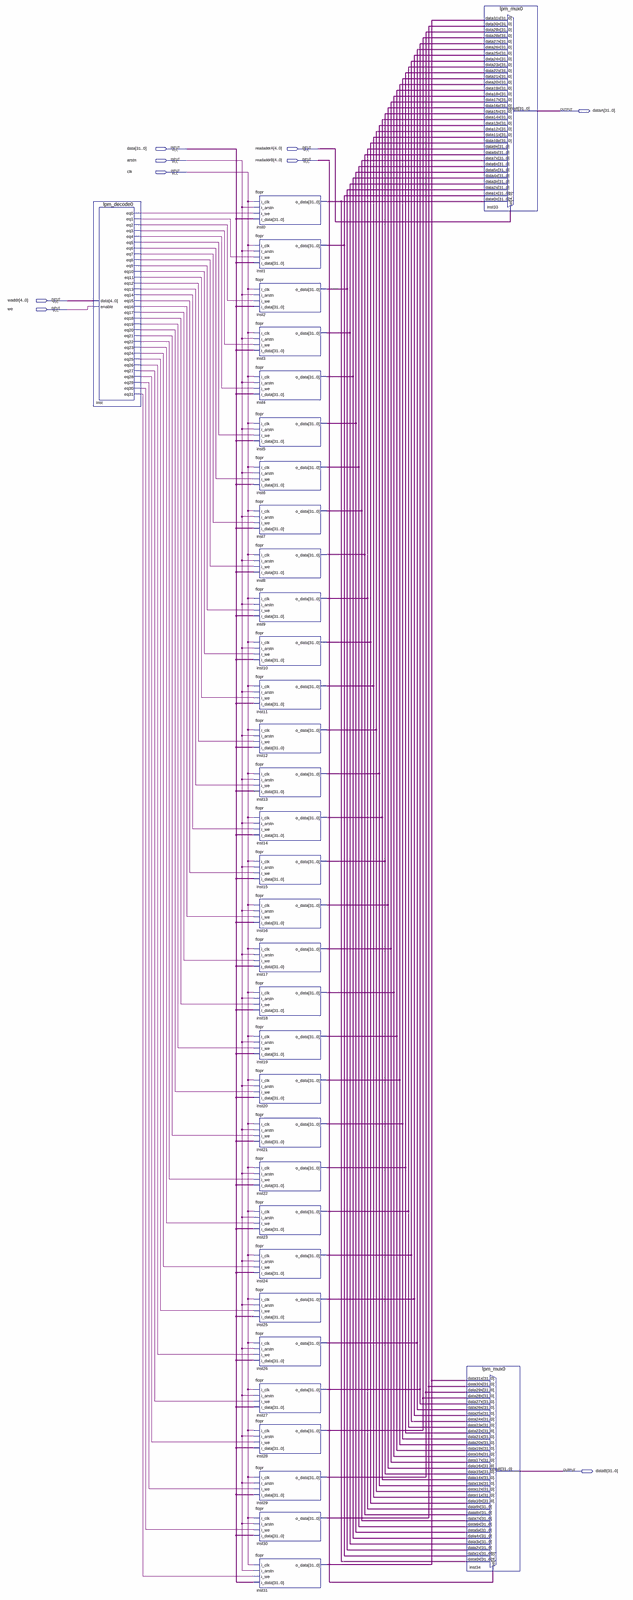
[diagram p0: schematic sheet, whole]
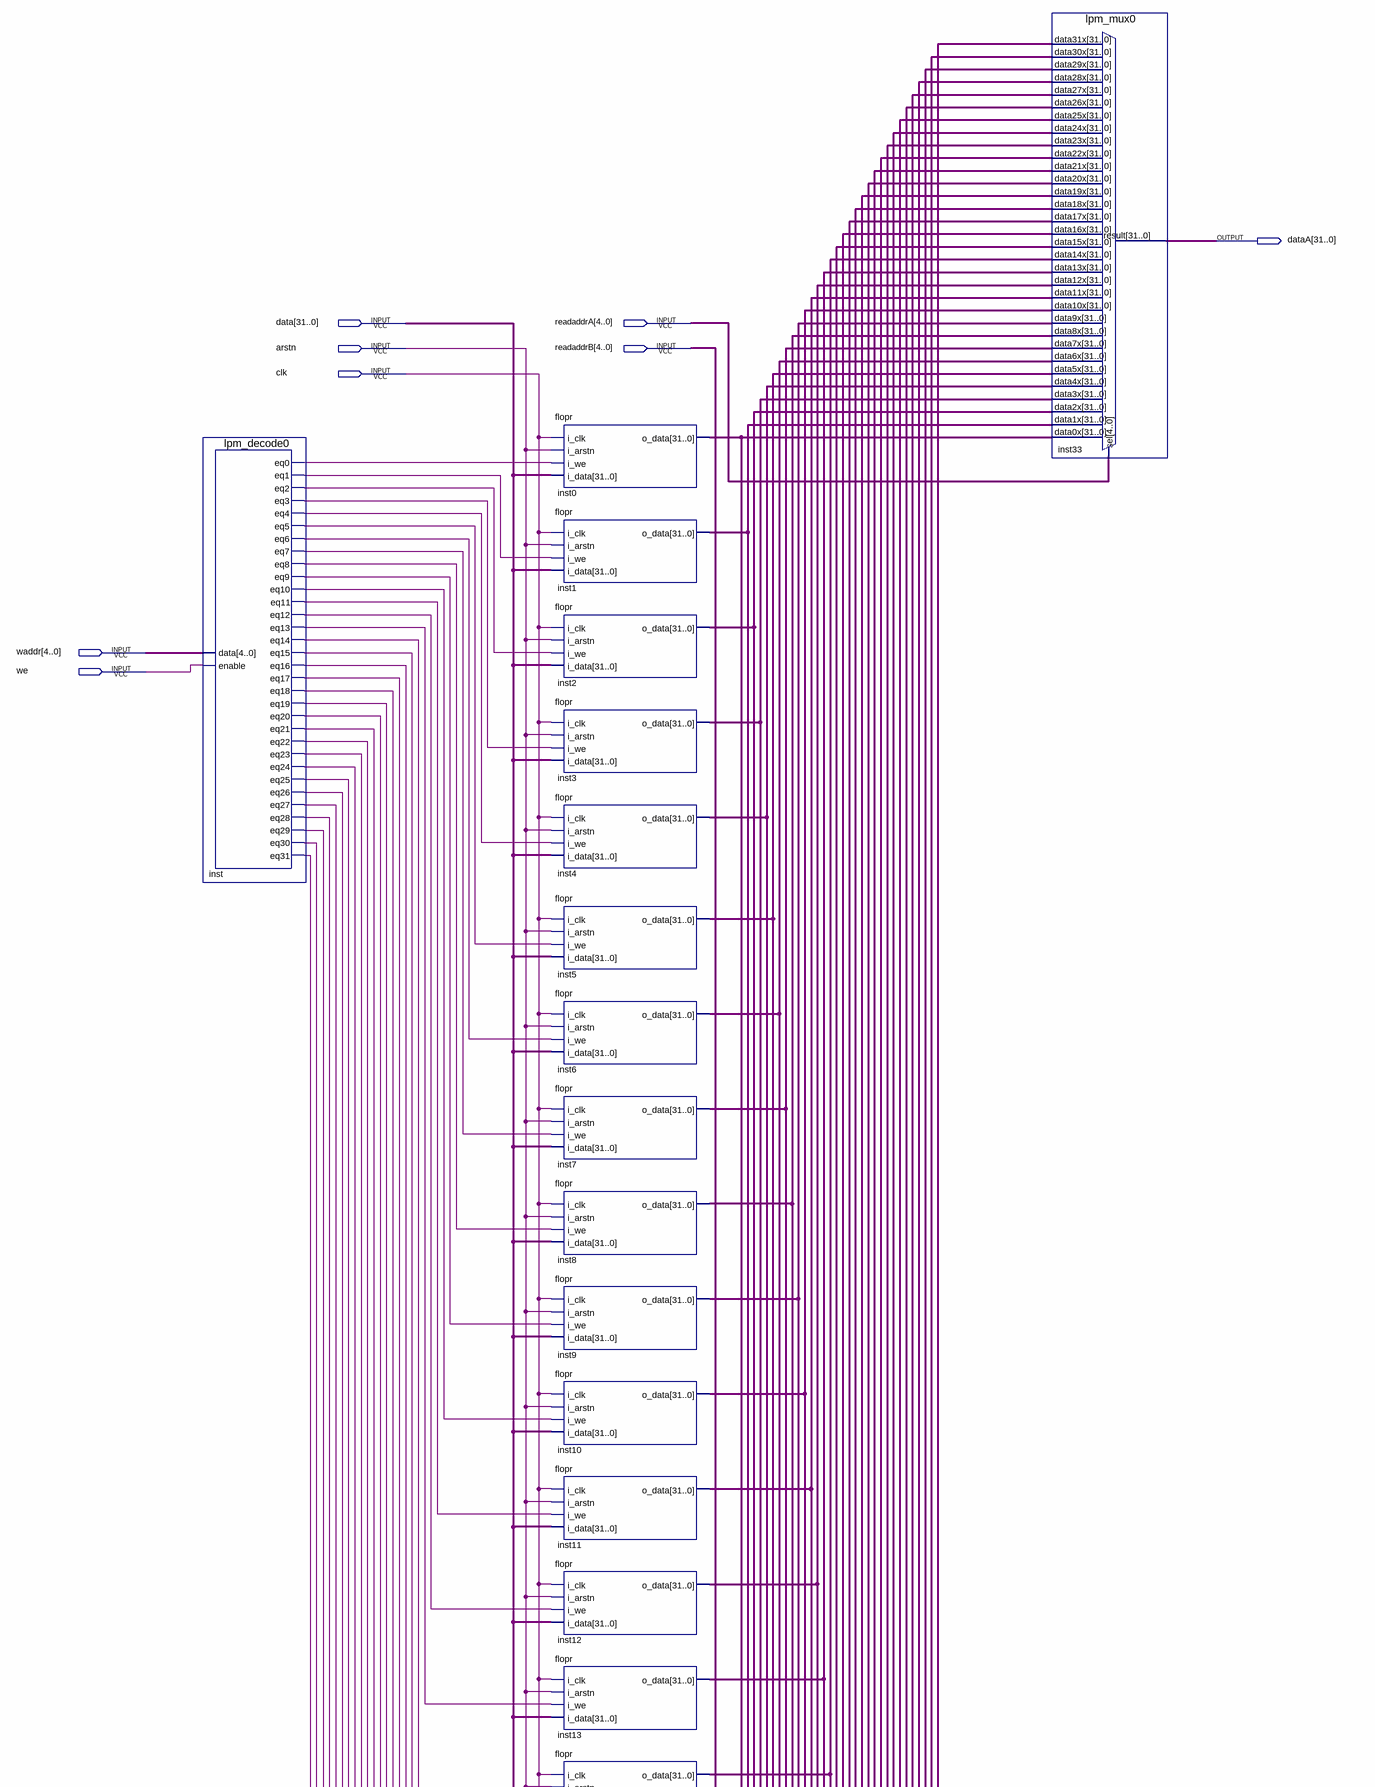
[diagram p1: schematic sheet, upper part]
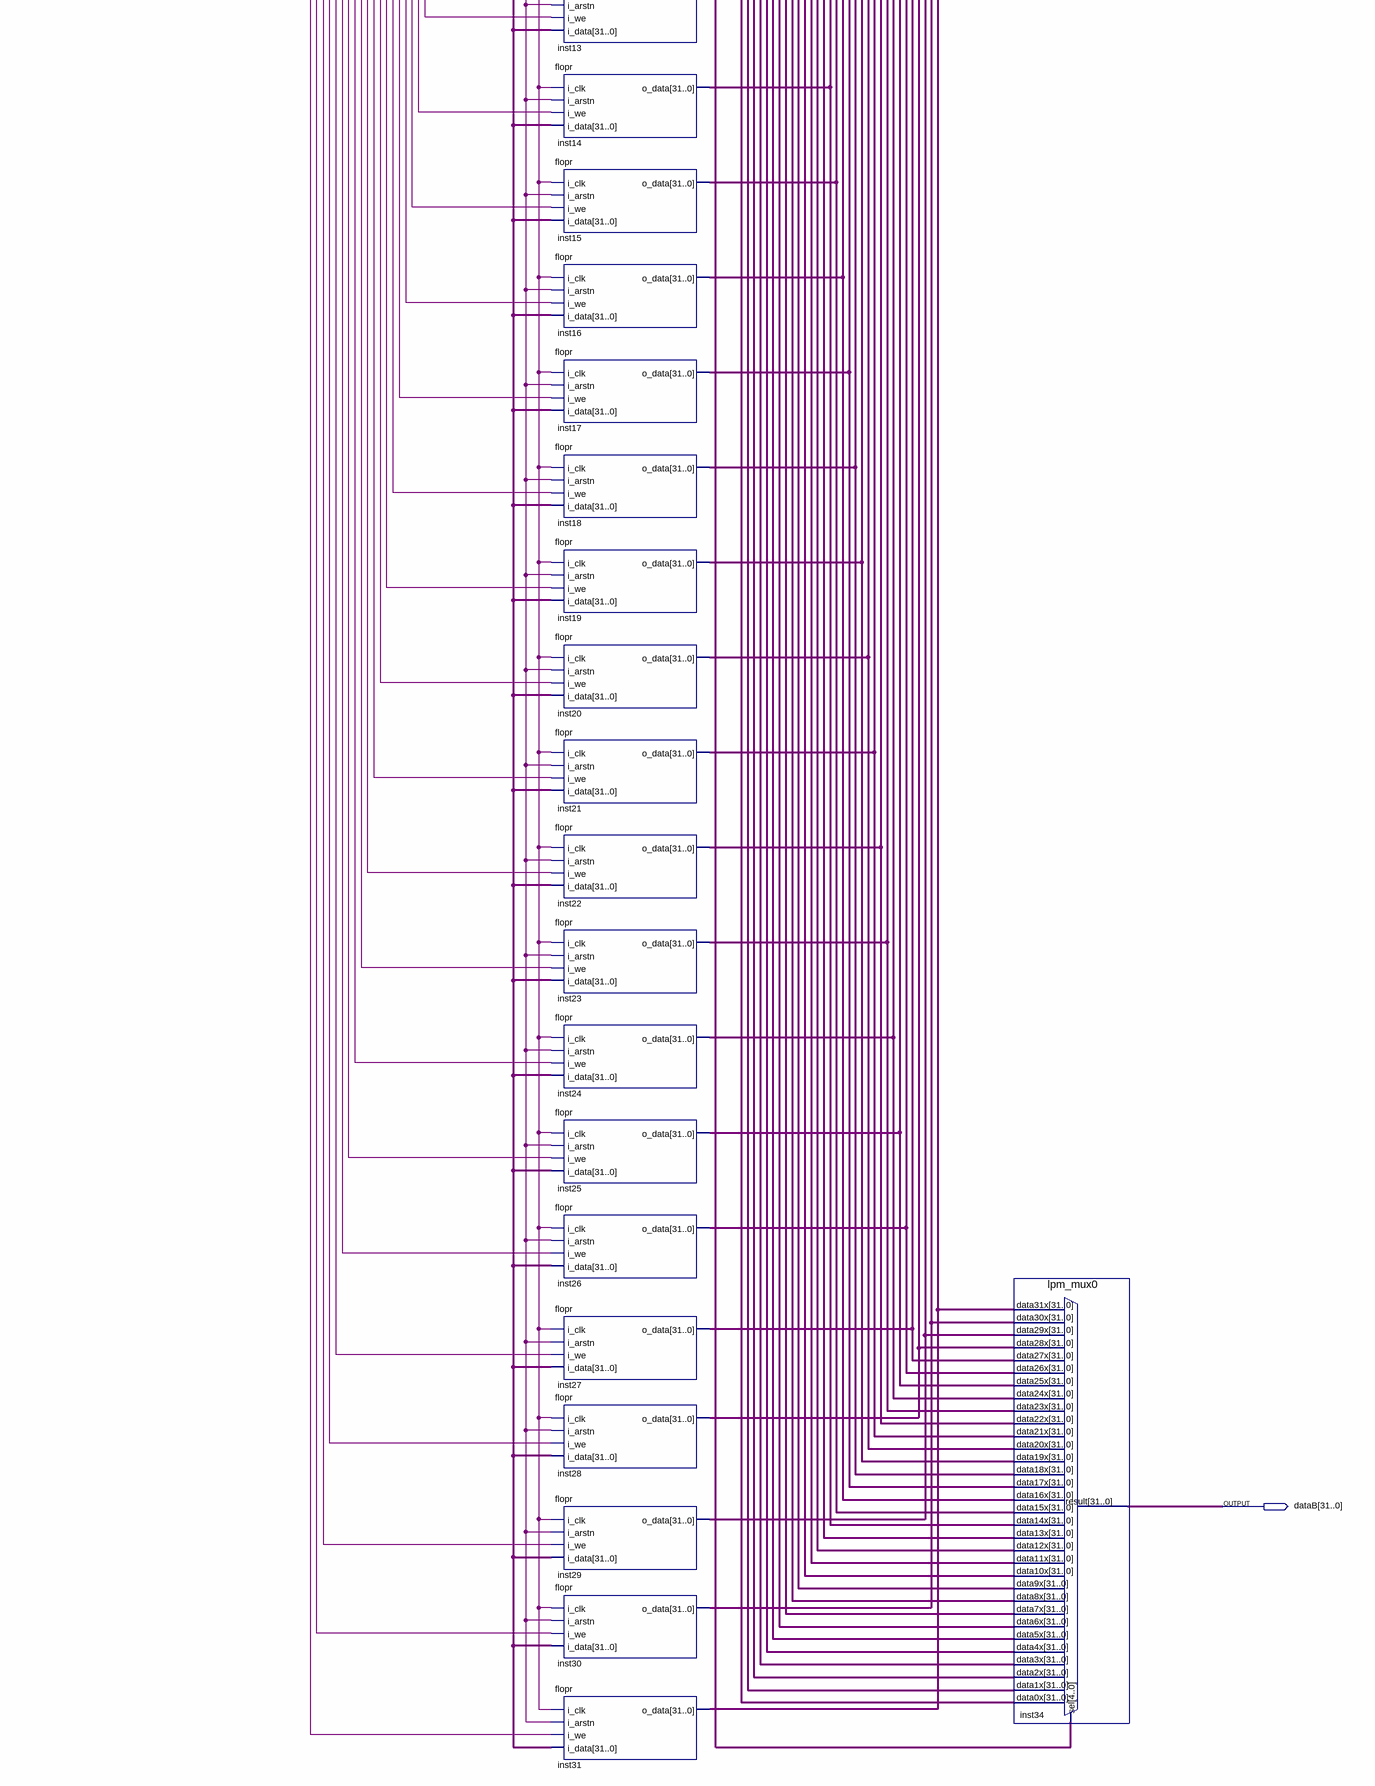
[diagram p2: schematic sheet, lower part]
// Quartus schematic lab2.bdf as structural Verilog: 35 symbols, 9 pins
module lab2 (
  input  [31:0] data,
  input  [4:0] readaddrA,
  input  arstn,
  input  [4:0] readaddrB,
  input  clk,
  input  [4:0] waddr,
  input  we,
  output [31:0] dataA,
  output [31:0] dataB
);

  wire inst_eq0, inst_eq1, inst_eq2, inst_eq3, inst_eq4, inst_eq5, inst_eq6, inst_eq7, inst_eq8, inst_eq9,
       inst_eq10, inst_eq11, inst_eq12, inst_eq13, inst_eq14, inst_eq15, inst_eq16, inst_eq17, inst_eq18,
       inst_eq19, inst_eq20, inst_eq21, inst_eq22, inst_eq23, inst_eq24, inst_eq25, inst_eq26, inst_eq27,
       inst_eq28, inst_eq29, inst_eq30, inst_eq31;
  wire [31:0] inst0_o_data, inst1_o_data, inst2_o_data, inst3_o_data, inst4_o_data, inst5_o_data,
       inst6_o_data, inst7_o_data, inst8_o_data, inst9_o_data, inst10_o_data, inst11_o_data, inst12_o_data,
       inst13_o_data, inst14_o_data, inst15_o_data, inst16_o_data, inst17_o_data, inst18_o_data,
       inst19_o_data, inst20_o_data, inst21_o_data, inst22_o_data, inst23_o_data, inst24_o_data,
       inst25_o_data, inst26_o_data, inst27_o_data, inst28_o_data, inst29_o_data, inst30_o_data,
       inst31_o_data;

  lpm_decode0 inst (
    .data(waddr), .enable(we), .eq0(inst_eq0), .eq1(inst_eq1), .eq2(inst_eq2), .eq3(inst_eq3),
    .eq4(inst_eq4), .eq5(inst_eq5), .eq6(inst_eq6), .eq7(inst_eq7), .eq8(inst_eq8), .eq9(inst_eq9),
    .eq10(inst_eq10), .eq11(inst_eq11), .eq12(inst_eq12), .eq13(inst_eq13), .eq14(inst_eq14),
    .eq15(inst_eq15), .eq16(inst_eq16), .eq17(inst_eq17), .eq18(inst_eq18), .eq19(inst_eq19),
    .eq20(inst_eq20), .eq21(inst_eq21), .eq22(inst_eq22), .eq23(inst_eq23), .eq24(inst_eq24),
    .eq25(inst_eq25), .eq26(inst_eq26), .eq27(inst_eq27), .eq28(inst_eq28), .eq29(inst_eq29),
    .eq30(inst_eq30), .eq31(inst_eq31));
  flopr inst0 (.i_clk(clk), .i_arstn(arstn), .i_we(inst_eq0), .i_data(data), .o_data(inst0_o_data));
  flopr inst1 (.i_clk(clk), .i_arstn(arstn), .i_we(inst_eq1), .i_data(data), .o_data(inst1_o_data));
  flopr inst2 (.i_clk(clk), .i_arstn(arstn), .i_we(inst_eq2), .i_data(data), .o_data(inst2_o_data));
  flopr inst3 (.i_clk(clk), .i_arstn(arstn), .i_we(inst_eq3), .i_data(data), .o_data(inst3_o_data));
  flopr inst4 (.i_clk(clk), .i_arstn(arstn), .i_we(inst_eq4), .i_data(data), .o_data(inst4_o_data));
  flopr inst5 (.i_clk(clk), .i_arstn(arstn), .i_we(inst_eq5), .i_data(data), .o_data(inst5_o_data));
  flopr inst6 (.i_clk(clk), .i_arstn(arstn), .i_we(inst_eq6), .i_data(data), .o_data(inst6_o_data));
  flopr inst7 (.i_clk(clk), .i_arstn(arstn), .i_we(inst_eq7), .i_data(data), .o_data(inst7_o_data));
  flopr inst8 (.i_clk(clk), .i_arstn(arstn), .i_we(inst_eq8), .i_data(data), .o_data(inst8_o_data));
  flopr inst9 (.i_clk(clk), .i_arstn(arstn), .i_we(inst_eq9), .i_data(data), .o_data(inst9_o_data));
  flopr inst10 (.i_clk(clk), .i_arstn(arstn), .i_we(inst_eq10), .i_data(data), .o_data(inst10_o_data));
  flopr inst11 (.i_clk(clk), .i_arstn(arstn), .i_we(inst_eq11), .i_data(data), .o_data(inst11_o_data));
  flopr inst12 (.i_clk(clk), .i_arstn(arstn), .i_we(inst_eq12), .i_data(data), .o_data(inst12_o_data));
  flopr inst13 (.i_clk(clk), .i_arstn(arstn), .i_we(inst_eq13), .i_data(data), .o_data(inst13_o_data));
  flopr inst14 (.i_clk(clk), .i_arstn(arstn), .i_we(inst_eq14), .i_data(data), .o_data(inst14_o_data));
  flopr inst15 (.i_clk(clk), .i_arstn(arstn), .i_we(inst_eq15), .i_data(data), .o_data(inst15_o_data));
  flopr inst16 (.i_clk(clk), .i_arstn(arstn), .i_we(inst_eq16), .i_data(data), .o_data(inst16_o_data));
  flopr inst17 (.i_clk(clk), .i_arstn(arstn), .i_we(inst_eq17), .i_data(data), .o_data(inst17_o_data));
  flopr inst18 (.i_clk(clk), .i_arstn(arstn), .i_we(inst_eq18), .i_data(data), .o_data(inst18_o_data));
  flopr inst19 (.i_clk(clk), .i_arstn(arstn), .i_we(inst_eq19), .i_data(data), .o_data(inst19_o_data));
  flopr inst20 (.i_clk(clk), .i_arstn(arstn), .i_we(inst_eq20), .i_data(data), .o_data(inst20_o_data));
  flopr inst21 (.i_clk(clk), .i_arstn(arstn), .i_we(inst_eq21), .i_data(data), .o_data(inst21_o_data));
  flopr inst22 (.i_clk(clk), .i_arstn(arstn), .i_we(inst_eq22), .i_data(data), .o_data(inst22_o_data));
  flopr inst23 (.i_clk(clk), .i_arstn(arstn), .i_we(inst_eq23), .i_data(data), .o_data(inst23_o_data));
  flopr inst24 (.i_clk(clk), .i_arstn(arstn), .i_we(inst_eq24), .i_data(data), .o_data(inst24_o_data));
  flopr inst25 (.i_clk(clk), .i_arstn(arstn), .i_we(inst_eq25), .i_data(data), .o_data(inst25_o_data));
  flopr inst26 (.i_clk(clk), .i_arstn(arstn), .i_we(inst_eq26), .i_data(data), .o_data(inst26_o_data));
  flopr inst27 (.i_clk(clk), .i_arstn(arstn), .i_we(inst_eq27), .i_data(data), .o_data(inst27_o_data));
  flopr inst28 (.i_clk(clk), .i_arstn(arstn), .i_we(inst_eq28), .i_data(data), .o_data(inst28_o_data));
  flopr inst29 (.i_clk(clk), .i_arstn(arstn), .i_we(inst_eq29), .i_data(data), .o_data(inst29_o_data));
  flopr inst30 (.i_clk(clk), .i_arstn(arstn), .i_we(inst_eq30), .i_data(data), .o_data(inst30_o_data));
  flopr inst31 (.i_clk(clk), .i_arstn(arstn), .i_we(inst_eq31), .i_data(data), .o_data(inst31_o_data));
  lpm_mux0 inst34 (
    .data31x(inst31_o_data), .data30x(inst30_o_data), .data29x(inst29_o_data), .data28x(inst28_o_data),
    .data27x(inst27_o_data), .data26x(inst26_o_data), .data25x(inst25_o_data), .data24x(inst24_o_data),
    .data23x(inst23_o_data), .data22x(inst22_o_data), .data21x(inst21_o_data), .data20x(inst20_o_data),
    .data19x(inst19_o_data), .data18x(inst18_o_data), .data17x(inst17_o_data), .data16x(inst16_o_data),
    .data15x(inst15_o_data), .data14x(inst14_o_data), .data13x(inst13_o_data), .data12x(inst12_o_data),
    .data11x(inst11_o_data), .data10x(inst10_o_data), .data9x(inst9_o_data), .data8x(inst8_o_data),
    .data7x(inst7_o_data), .data6x(inst6_o_data), .data5x(inst5_o_data), .data4x(inst4_o_data),
    .data3x(inst3_o_data), .data2x(inst2_o_data), .data1x(inst1_o_data), .data0x(inst0_o_data),
    .sel(readaddrB), .result(dataB));
  lpm_mux0 inst33 (
    .data0x(inst0_o_data), .data10x(inst10_o_data), .data11x(inst11_o_data), .data12x(inst12_o_data),
    .data13x(inst13_o_data), .data14x(inst14_o_data), .data15x(inst15_o_data), .data16x(inst16_o_data),
    .data17x(inst17_o_data), .data18x(inst18_o_data), .data19x(inst19_o_data), .data1x(inst1_o_data),
    .data20x(inst20_o_data), .data21x(inst21_o_data), .data22x(inst22_o_data), .data23x(inst23_o_data),
    .data24x(inst24_o_data), .data25x(inst25_o_data), .data26x(inst26_o_data), .data27x(inst27_o_data),
    .data28x(inst28_o_data), .data29x(inst29_o_data), .data2x(inst2_o_data), .data30x(inst30_o_data),
    .data31x(inst31_o_data), .data3x(inst3_o_data), .data4x(inst4_o_data), .data5x(inst5_o_data),
    .data6x(inst6_o_data), .data7x(inst7_o_data), .data8x(inst8_o_data), .data9x(inst9_o_data),
    .sel(readaddrA), .result(dataA));
endmodule
